# EAGLE schematic zikzak3-memswitch3 (EAGLE 6.4)
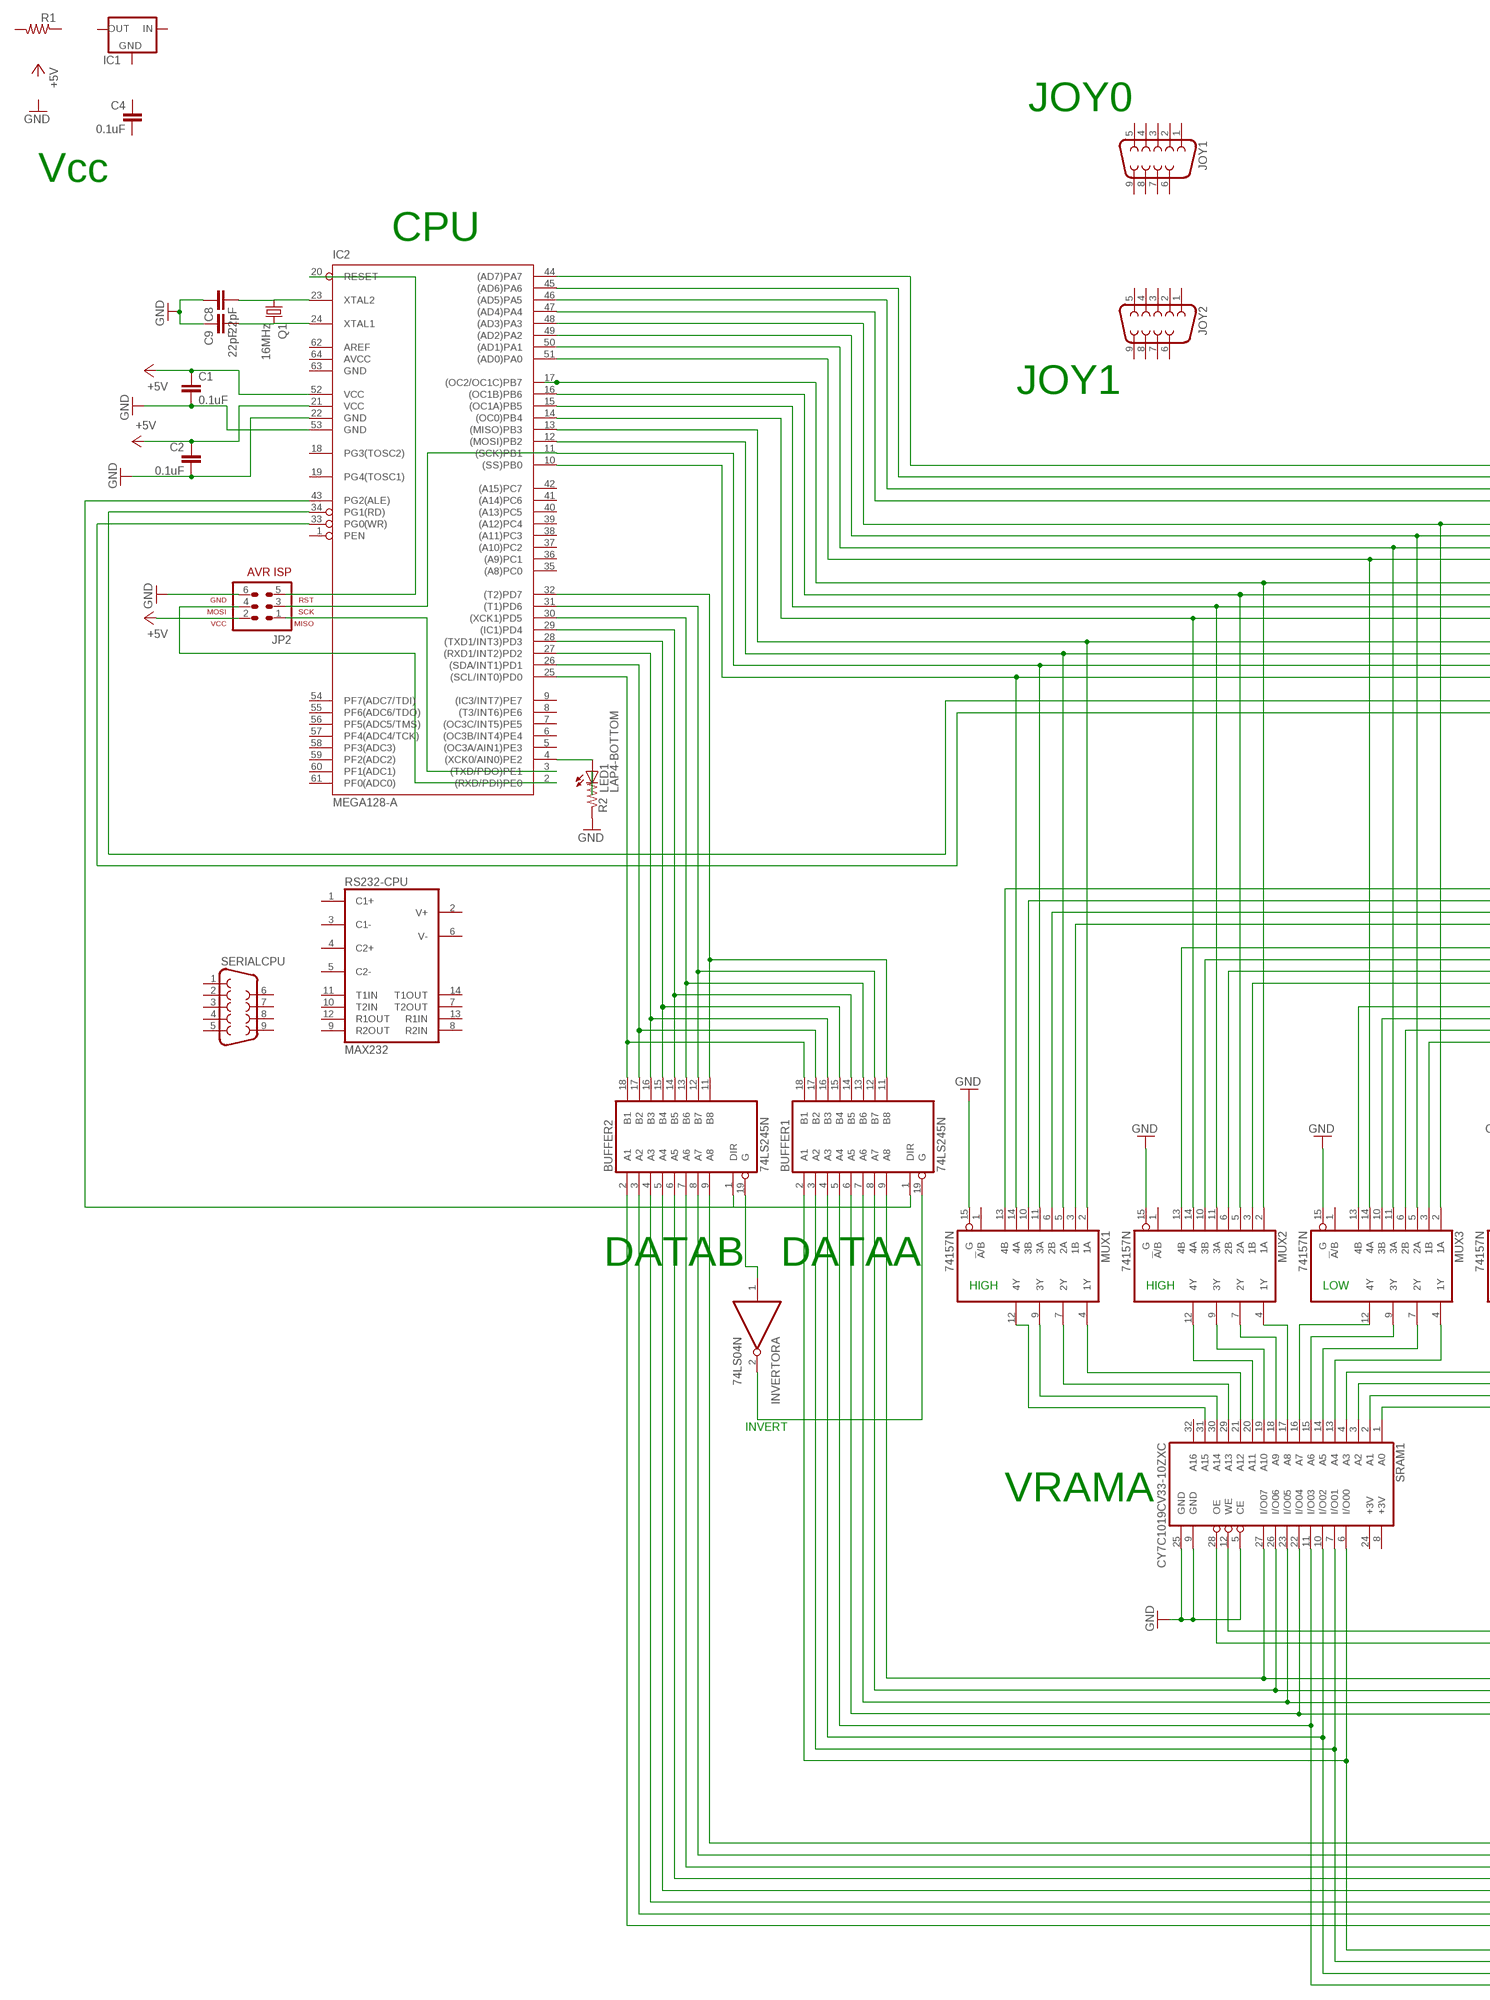
[diagram p0: schematic, sheet 1, part 1 of 2]
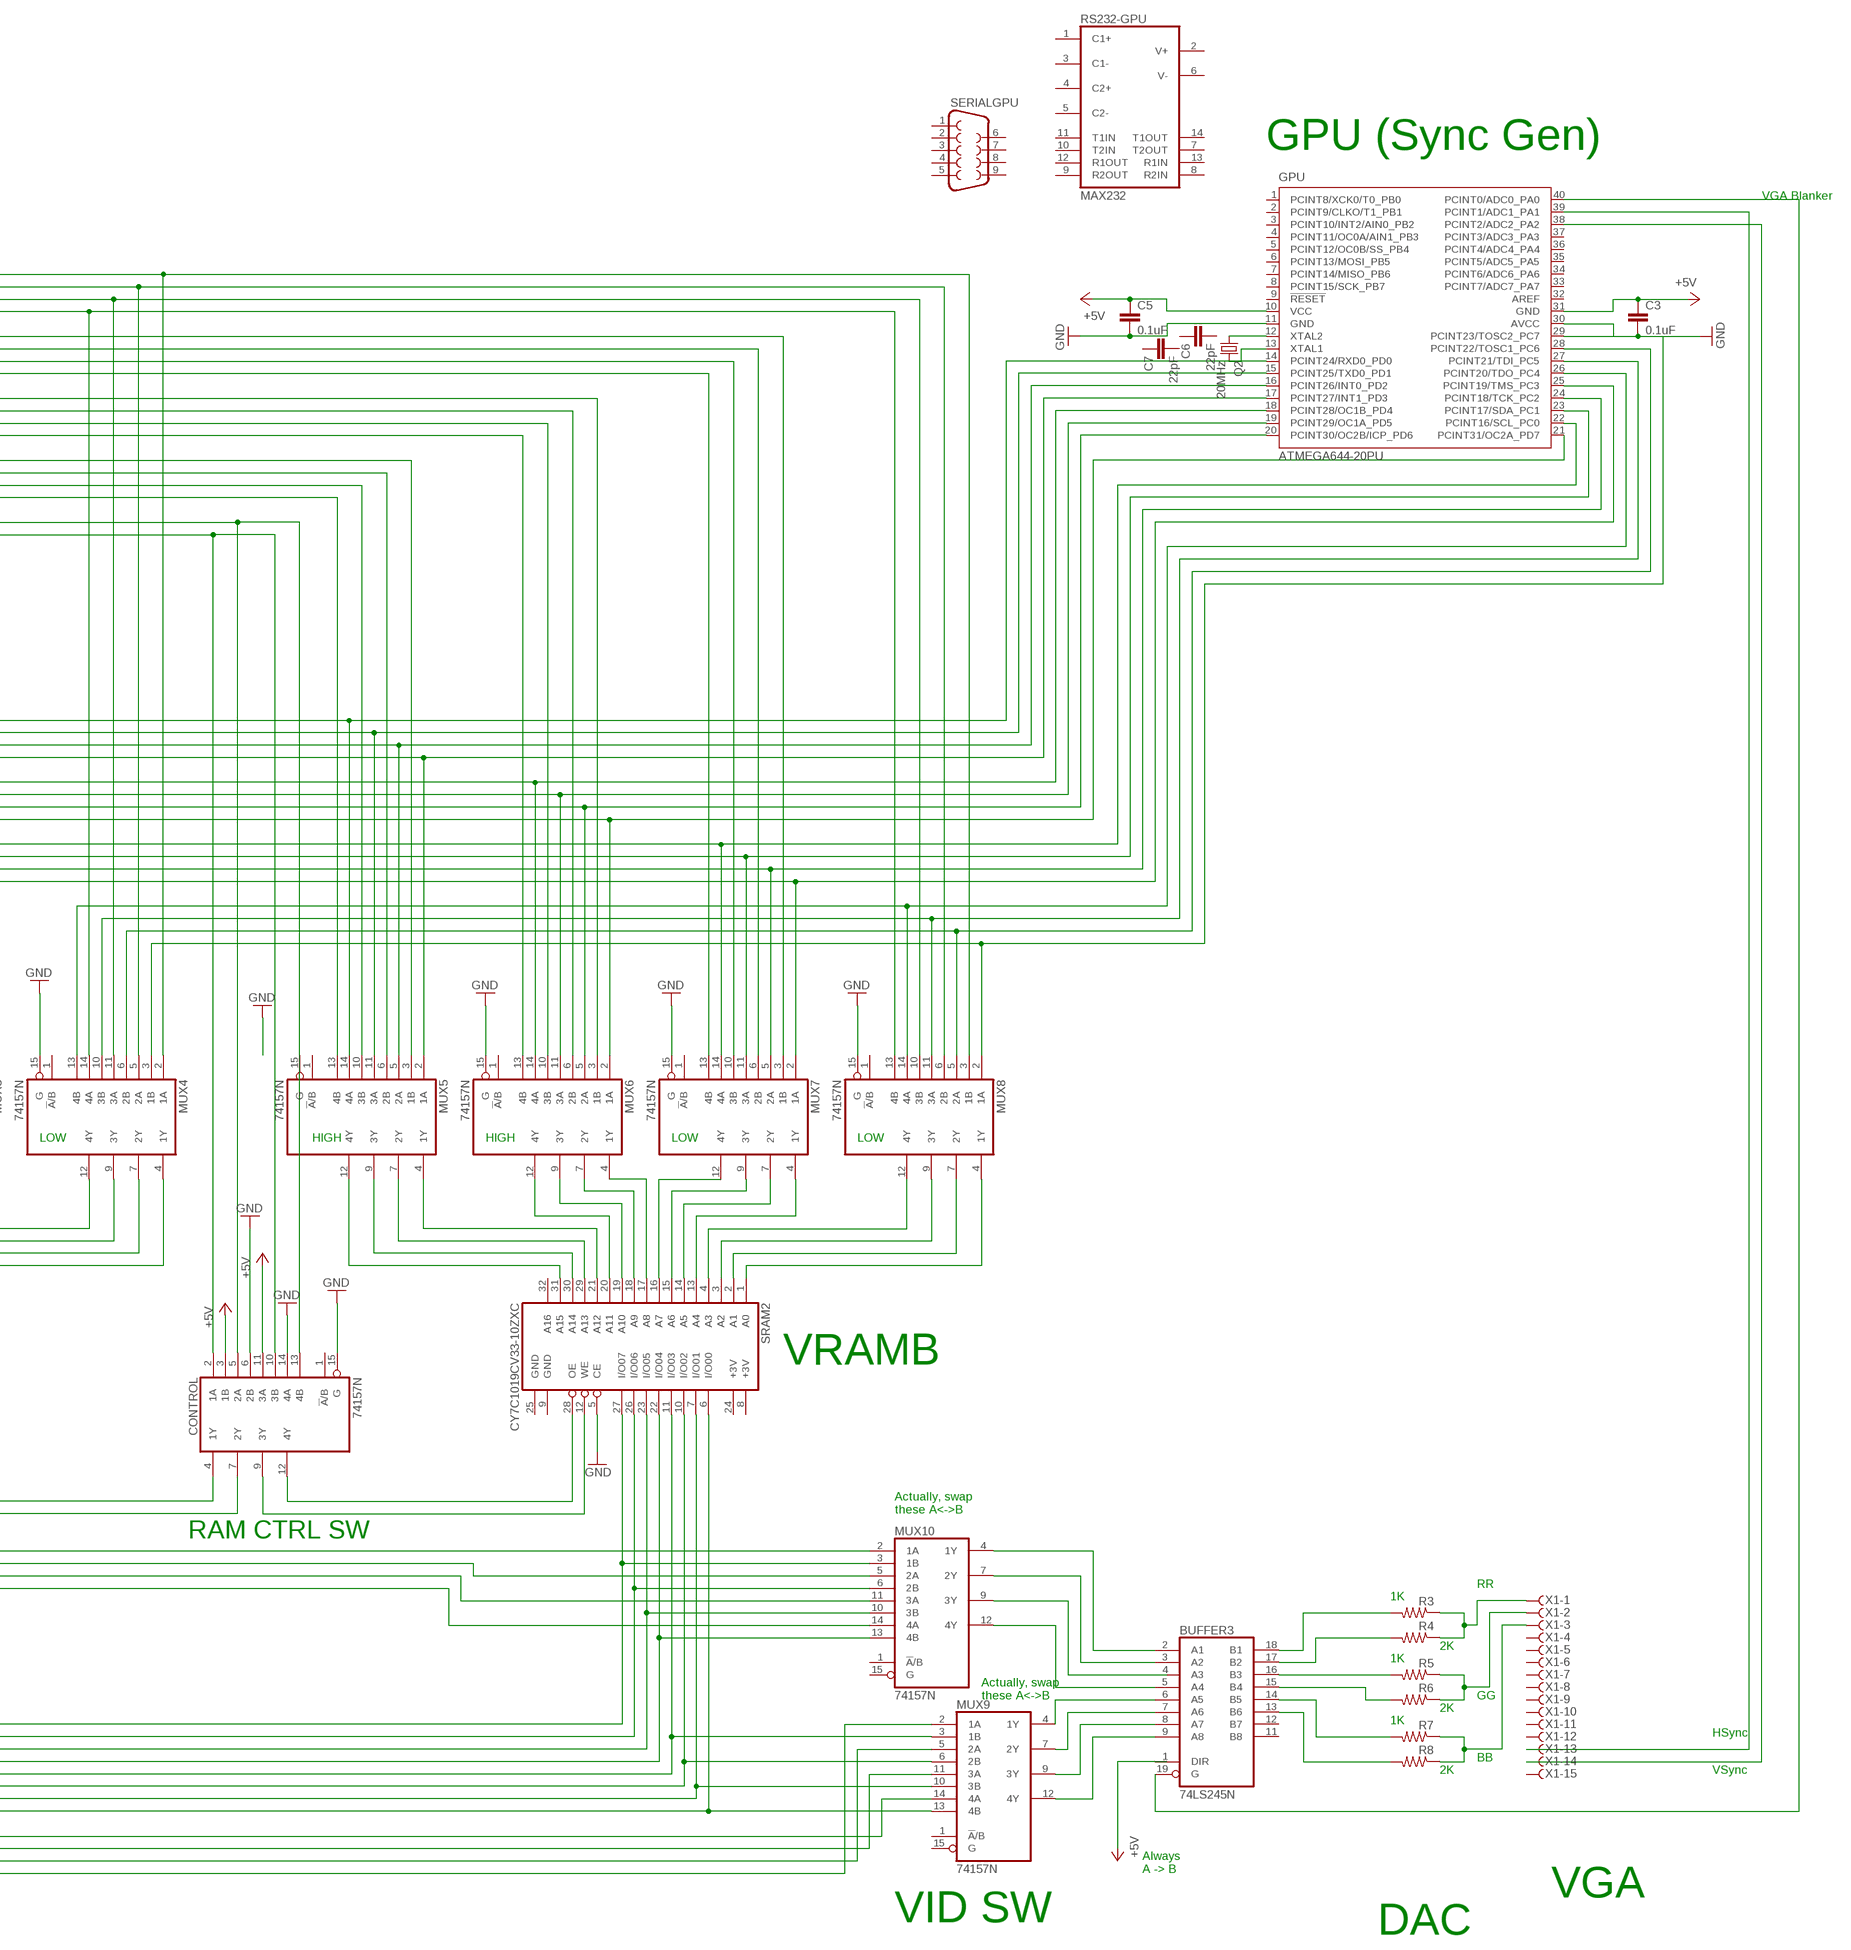
[diagram p1: schematic, sheet 1, part 2 of 2]

## Parts
BUFFER1  74LS245N  [DIL20]
BUFFER2  74LS245N  [DIL20]
BUFFER3  74LS245N  [DIL20]
C1  0.1uF  C2,5-3  [C2.5-3]
C2  0.1uF  C2,5-3  [C2.5-3]
C3  0.1uF  C2,5-3  [C2.5-3]
C4  0.1uF  C2,5-3  [C2.5-3]
C5  0.1uF  C2,5-3  [C2.5-3]
C6  22pF  C2,5-3  [C2.5-3]
C7  22pF  C2,5-3  [C2.5-3]
C8  22pF  C2,5-3  [C2.5-3]
C9  22pF  C2,5-3  [C2.5-3]
CONTROL  74157N  [DIL16]
GPU  ATMEGA644-20PU  [DIL40]
IC1  78MXXL  [78MXXL]
IC2  MEGA128-A  [TQFP64]
INVERTOR  74LS04N  [DIL14]
JOY1  F09H  [F09H]
JOY2  F09H  [F09H]
JP2  AVR-ISP-6VERT  [AVR-ISP-6]
LED1  LAP4-BOTTOM  [P47F-BOTTOM]
MUX1  74157N  [DIL16]
MUX2  74157N  [DIL16]
MUX3  74157N  [DIL16]
MUX4  74157N  [DIL16]
MUX5  74157N  [DIL16]
MUX6  74157N  [DIL16]
MUX7  74157N  [DIL16]
MUX8  74157N  [DIL16]
MUX9  74157N  [DIL16]
MUX10  74157N  [DIL16]
Q1  16MHz  CRYSTALTC38H  [TC38H]
Q2  20MHz  CRYSTALTC38H  [TC38H]
R1  R-US_0204/2V  [0204V]
R2  R-US_0204/2V  [0204V]
R3  R-US_0204/2V  [0204V]
R4  R-US_0204/2V  [0204V]
R5  R-US_0204/2V  [0204V]
R6  R-US_0204/2V  [0204V]
R7  R-US_0204/2V  [0204V]
R8  R-US_0204/2V  [0204V]
RS232-CPU  MAX232  [DIL16]
RS232-GPU  MAX232  [DIL16]
SERIALCPU  F09H  [F09H]
SERIALGPU  F09H  [F09H]
SRAM1  CY7C1019CV33-10ZXC  [TSOPII-32]
SRAM2  CY7C1019CV33-10ZXC  [TSOPII-32]
X1  F15HDVS  [HDF15V]

## Nets
+5V: C1.1 C2.1 C3.1 C5.1 CONTROL.3(1B) CONTROL.11(3A) GPU.10(VCC) GPU.31(GND) IC2.21(VCC) IC2.52(VCC) JP2.2
GND: C1.2 C2.2 C3.2 C5.2 C8.1 C9.1 CONTROL.6(2B) CONTROL.14(4A) CONTROL.15(G) GPU.11(GND) GPU.30(AVCC) IC2.22(GND) IC2.53(GND) JP2.6 MUX1.15(G) MUX2.15(G) MUX3.15(G) MUX4.15(G) MUX6.15(G) MUX7.15(G) MUX8.15(G) R2.1 SRAM1.5(CE) SRAM1.9(GND) SRAM1.25(GND) SRAM2.5(CE)
N$1: LED1.C R2.2
N$2: CONTROL.5(2A) CONTROL.13(4B) IC2.34(PG1(RD))
N$3: CONTROL.2(1A) CONTROL.10(3B) IC2.33(PG0(WR))
N$4: CONTROL.7(2Y) SRAM1.28(OE)
N$5: CONTROL.4(1Y) SRAM1.12(WE)
N$6: CONTROL.9(3Y) SRAM2.12(WE)
N$7: IC2.4((XCK0/AIN0)PE2) LED1.A
N$8: CONTROL.12(4Y) SRAM2.28(OE)
N$9: GPU.12(XTAL2) Q2.1
N$10: GPU.13(XTAL1) Q2.2
N$11: BUFFER3.5(A4) MUX10.12(4Y)
N$12: MUX10.9(3Y)
N$13: MUX6.4(1Y) SRAM2.17(A8)
N$14: MUX6.7(2Y) SRAM2.18(A9)
N$15: MUX6.9(3Y) SRAM2.19(A10)
N$16: MUX6.12(4Y) SRAM2.20(A11)
N$17: MUX5.4(1Y) SRAM2.21(A12)
N$18: MUX5.7(2Y) SRAM2.29(A13)
N$19: MUX5.9(3Y) SRAM2.30(A14)
N$20: MUX5.12(4Y) SRAM2.31(A15)
N$21: MUX7.12(4Y) SRAM2.16(A7)
N$22: MUX7.9(3Y) SRAM2.15(A6)
N$23: MUX7.7(2Y) SRAM2.14(A5)
N$24: MUX7.4(1Y) SRAM2.13(A4)
N$25: MUX8.12(4Y) SRAM2.4(A3)
N$26: MUX8.9(3Y) SRAM2.3(A2)
N$27: MUX8.7(2Y) SRAM2.2(A1)
N$28: MUX8.4(1Y) SRAM2.1(A0)
N$29: GPU.14(PCINT24/RXD0_PD0) MUX1.13(4B) MUX5.14(4A)
N$30: GPU.15(PCINT25/TXD0_PD1) MUX1.10(3B) MUX5.11(3A)
N$31: GPU.16(PCINT26/INT0_PD2) MUX1.6(2B) MUX5.5(2A)
N$32: GPU.17(PCINT27/INT1_PD3) MUX1.3(1B) MUX5.2(1A)
N$33: GPU.18(PCINT28/OC1B_PD4) MUX2.13(4B) MUX6.14(4A)
N$34: GPU.19(PCINT29/OC1A_PD5) MUX2.10(3B) MUX6.11(3A)
N$35: GPU.20(PCINT30/OC2B/ICP_PD6) MUX2.6(2B) MUX6.5(2A)
N$36: GPU.21(PCINT31/OC2A_PD7) MUX2.3(1B) MUX6.2(1A)
N$37: GPU.22(PCINT16/SCL_PC0) MUX3.13(4B) MUX7.14(4A)
N$38: GPU.23(PCINT17/SDA_PC1) MUX3.10(3B) MUX7.11(3A)
N$39: GPU.24(PCINT18/TCK_PC2) MUX3.6(2B) MUX7.5(2A)
N$40: GPU.25(PCINT19/TMS_PC3) MUX3.3(1B) MUX7.2(1A)
N$41: GPU.26(PCINT20/TDO_PC4) MUX4.13(4B) MUX8.14(4A)
N$42: GPU.27(PCINT21/TDI_PC5) MUX4.10(3B) MUX8.11(3A)
N$43: GPU.28(PCINT22/TOSC1_PC6) MUX4.6(2B) MUX8.5(2A)
N$44: GPU.29(PCINT23/TOSC2_PC7) MUX4.3(1B) MUX8.2(1A)
N$45: MUX3.12(4Y) SRAM1.16(A7)
N$46: MUX3.9(3Y) SRAM1.15(A6)
N$47: MUX3.7(2Y) SRAM1.14(A5)
N$48: MUX3.4(1Y) SRAM1.13(A4)
N$49: MUX4.12(4Y) SRAM1.4(A3)
N$50: MUX4.9(3Y) SRAM1.3(A2)
N$51: MUX4.7(2Y) SRAM1.2(A1)
N$52: MUX4.4(1Y) SRAM1.1(A0)
N$53: MUX2.4(1Y) SRAM1.17(A8)
N$54: MUX2.7(2Y) SRAM1.18(A9)
N$55: MUX2.9(3Y) SRAM1.19(A10)
N$56: MUX2.12(4Y) SRAM1.20(A11)
N$57: MUX1.4(1Y) SRAM1.21(A12)
N$58: MUX1.7(2Y) SRAM1.29(A13)
N$59: MUX1.9(3Y) SRAM1.30(A14)
N$60: MUX1.12(4Y) SRAM1.31(A15)
N$61: IC2.44((AD7)PA7) MUX4.2(1A) MUX8.3(1B)
N$62: IC2.45((AD6)PA6) MUX4.5(2A) MUX8.6(2B)
N$63: IC2.46((AD5)PA5) MUX4.11(3A) MUX8.10(3B)
N$64: IC2.47((AD4)PA4) MUX4.14(4A) MUX8.13(4B)
N$65: IC2.48((AD3)PA3) MUX3.2(1A) MUX7.3(1B)
N$66: IC2.49((AD2)PA2) MUX3.5(2A) MUX7.6(2B)
N$67: IC2.50((AD1)PA1) MUX3.11(3A) MUX7.10(3B)
N$68: IC2.51((AD0)PA0) MUX3.14(4A) MUX7.13(4B)
N$69: IC2.17((OC2/OC1C)PB7) MUX2.2(1A) MUX6.3(1B)
N$70: IC2.16((OC1B)PB6) MUX2.5(2A) MUX6.6(2B)
N$71: IC2.15((OC1A)PB5) MUX2.11(3A) MUX6.10(3B)
N$72: IC2.14((OC0)PB4) MUX2.14(4A) MUX6.13(4B)
N$73: IC2.13((MISO)PB3) MUX1.2(1A) MUX5.3(1B)
N$74: IC2.12((MOSI)PB2) MUX1.5(2A) MUX5.6(2B)
N$75: MUX1.11(3A) MUX5.10(3B)
N$76: IC2.10((SS)PB0) MUX1.14(4A) MUX5.13(4B)
N$77: BUFFER1.9(A8) MUX10.2(1A) SRAM1.27(I/O07)
N$78: IC2.2((RXD/PDI)PE0) JP2.4
N$79: IC2.3((TXD/PDO)PE1) JP2.1
N$80: IC2.11((SCK)PB1) JP2.3
N$81: IC2.20(RESET) JP2.5
N$82: BUFFER1.8(A7) MUX10.5(2A) SRAM1.26(I/O06)
N$83: BUFFER1.7(A6) MUX10.11(3A) SRAM1.23(I/O05)
N$84: BUFFER1.6(A5) MUX10.14(4A) SRAM1.22(I/O04)
N$85: BUFFER1.5(A4) MUX9.2(1A) SRAM1.11(I/O03)
N$86: BUFFER1.4(A3) MUX9.5(2A) SRAM1.10(I/O02)
N$87: BUFFER1.3(A2) MUX9.11(3A) SRAM1.7(I/O01)
N$88: BUFFER1.2(A1) MUX9.14(4A) SRAM1.6(I/O00)
N$89: BUFFER2.9(A8) MUX10.3(1B) SRAM2.27(I/O07)
N$90: BUFFER2.8(A7) MUX10.6(2B) SRAM2.26(I/O06)
N$91: BUFFER2.7(A6) MUX10.10(3B) SRAM2.23(I/O05)
N$92: BUFFER2.6(A5) MUX10.13(4B) SRAM2.22(I/O04)
N$93: BUFFER2.5(A4) MUX9.3(1B) SRAM2.11(I/O03)
N$94: BUFFER2.4(A3) MUX9.6(2B) SRAM2.10(I/O02)
N$95: BUFFER2.3(A2) MUX9.10(3B) SRAM2.7(I/O01)
N$96: BUFFER2.2(A1) MUX9.13(4B) SRAM2.6(I/O00)
N$97: BUFFER1.18(B1) BUFFER2.18(B1) IC2.25((SCL/INT0)PD0)
N$98: BUFFER1.17(B2) BUFFER2.17(B2) IC2.26((SDA/INT1)PD1)
N$99: BUFFER1.16(B3) BUFFER2.16(B3) IC2.27((RXD1/INT2)PD2)
N$100: BUFFER1.15(B4) BUFFER2.15(B4) IC2.28((TXD1/INT3)PD3)
N$101: BUFFER1.14(B5) BUFFER2.14(B5) IC2.29((IC1)PD4)
N$102: BUFFER1.13(B6) BUFFER2.13(B6) IC2.30((XCK1)PD5)
N$103: BUFFER1.12(B7) BUFFER2.12(B7) IC2.31((T1)PD6)
N$104: BUFFER1.11(B8) BUFFER2.11(B8) IC2.32((T2)PD7)
N$105: BUFFER3.3(A2) MUX10.7(2Y)
N$106: BUFFER3.2(A1) MUX10.4(1Y)
N$107: BUFFER2.19(G) INVERTOR.1(A:I)
N$108: BUFFER1.19(G) INVERTOR.2(A:O)
N$109: BUFFER3.6(A5) MUX9.4(1Y)
N$110: BUFFER3.7(A6) MUX9.7(2Y)
N$111: BUFFER3.8(A7) MUX9.9(3Y)
N$112: BUFFER3.9(A8) MUX9.12(4Y)
N$113: BUFFER3.18(B1) R3.2
N$114: BUFFER3.17(B2) R4.2
N$115: BUFFER3.16(B3) R5.2
N$116: BUFFER3.15(B4) R6.2
N$117: BUFFER3.14(B5) R7.2
N$118: BUFFER3.13(B6) R8.2
N$119: R3.1 R4.1 X1.1
N$120: C8.2 IC2.23(XTAL2) Q1.1
N$121: R5.1 R6.1 X1.2
N$122: GPU.39(PCINT1/ADC1_PA1) X1.13
N$123: R7.1 R8.1 X1.3
N$124: GPU.38(PCINT2/ADC2_PA2) X1.14
N$125: BUFFER3.19(G) GPU.40(PCINT0/ADC0_PA0)
N$126: C9.2 IC2.24(XTAL1) Q1.2
N$128: BUFFER1.1(DIR) BUFFER2.1(DIR) IC2.43(PG2(ALE))
Unconnected: BUFFER3.1(DIR) BUFFER3.4(A3) BUFFER3.11(B8) BUFFER3.12(B7) C4.1 C4.2 C6.1 C6.2 C7.1 C7.2 CONTROL.1(!A!/B) GPU.1(PCINT8/XCK0/T0_PB0) GPU.2(PCINT9/CLKO/T1_PB1) GPU.3(PCINT10/INT2/AIN0_PB2) GPU.4(PCINT11/OC0A/AIN1_PB3) GPU.5(PCINT12/OC0B/SS_PB4) GPU.6(PCINT13/MOSI_PB5) GPU.7(PCINT14/MISO_PB6) GPU.8(PCINT15/SCK_PB7) GPU.9(!RESET) GPU.32(AREF) GPU.33(PCINT7/ADC7_PA7) GPU.34(PCINT6/ADC6_PA6) GPU.35(PCINT5/ADC5_PA5) GPU.36(PCINT4/ADC4_PA4) GPU.37(PCINT3/ADC3_PA3) IC1.GND IC1.IN IC1.OUT IC2.1(PEN) IC2.5((OC3A/AIN1)PE3) IC2.6((OC3B/INT4)PE4) IC2.7((OC3C/INT5)PE5) IC2.8((T3/INT6)PE6) IC2.9((IC3/INT7)PE7) IC2.18(PG3(TOSC2)) IC2.19(PG4(TOSC1)) IC2.35((A8)PC0) IC2.36((A9)PC1) IC2.37((A10)PC2) IC2.38((A11)PC3) IC2.39((A12)PC4) IC2.40((A13)PC5) IC2.41((A14)PC6) IC2.42((A15)PC7) IC2.54(PF7(ADC7/TDI)) IC2.55(PF6(ADC6/TDO)) IC2.56(PF5(ADC5/TMS)) IC2.57(PF4(ADC4/TCK)) IC2.58(PF3(ADC3)) IC2.59(PF2(ADC2)) IC2.60(PF1(ADC1)) IC2.61(PF0(ADC0)) IC2.62(AREF) INVERTOR.3(B:I) INVERTOR.4(B:O) INVERTOR.5(C:I) INVERTOR.6(C:O) INVERTOR.8(D:O) INVERTOR.9(D:I) INVERTOR.10(E:O) INVERTOR.11(E:I) INVERTOR.12(F:O) INVERTOR.13(F:I) JOY1.1 JOY1.2 JOY1.3 JOY1.4 JOY1.5 JOY1.6 JOY1.7 JOY1.8 JOY1.9 JOY2.1 JOY2.2 JOY2.3 JOY2.4 JOY2.5 JOY2.6 JOY2.7 JOY2.8 JOY2.9 MUX1.1(!A!/B) MUX2.1(!A!/B) MUX3.1(!A!/B) MUX4.1(!A!/B) MUX5.1(!A!/B) MUX5.15(G) MUX6.1(!A!/B) MUX7.1(!A!/B) MUX8.1(!A!/B) MUX9.1(!A!/B) MUX9.15(G) MUX10.1(!A!/B) MUX10.15(G) R1.1 R1.2 RS232-CPU.1(C1+) RS232-CPU.2(V+) RS232-CPU.3(C1-) RS232-CPU.4(C2+) RS232-CPU.5(C2-) RS232-CPU.6(V-) RS232-CPU.7(T2OUT) RS232-CPU.8(R2IN) RS232-CPU.9(R2OUT) RS232-CPU.10(T2IN) RS232-CPU.11(T1IN) RS232-CPU.12(R1OUT) RS232-CPU.13(R1IN) RS232-CPU.14(T1OUT) RS232-GPU.1(C1+) RS232-GPU.2(V+) RS232-GPU.3(C1-) RS232-GPU.4(C2+) RS232-GPU.5(C2-) RS232-GPU.6(V-) RS232-GPU.7(T2OUT) RS232-GPU.8(R2IN) RS232-GPU.9(R2OUT) RS232-GPU.10(T2IN) RS232-GPU.11(T1IN) RS232-GPU.12(R1OUT) RS232-GPU.13(R1IN) RS232-GPU.14(T1OUT) SERIALCPU.1 SERIALCPU.2 SERIALCPU.3 SERIALCPU.4 SERIALCPU.5 SERIALCPU.6 SERIALCPU.7 SERIALCPU.8 SERIALCPU.9 SERIALGPU.1 SERIALGPU.2 SERIALGPU.3 SERIALGPU.4 SERIALGPU.5 SERIALGPU.6 SERIALGPU.7 SERIALGPU.8 SERIALGPU.9 SRAM1.32(A16) SRAM2.32(A16) X1.4 X1.5 X1.6 X1.7 X1.8 X1.9 X1.10 X1.11 X1.12 X1.15

## Notes on the sheet
- JOY0
- Vcc
- CPU
- GPU (Sync Gen)
- JOY1 | VGA Blanker
- DATAB | DATAA
- HIGH | HIGH | LOW | LOW | HIGH | HIGH | LOW | LOW
- INVERT
- VRAMA | VRAMB
- Actually, swap
  these A<->B
- RAM CTRL SW
- RR
- 1K
- 2K
- 1K
- Actually, swap
  these A<->B
- GG
- 2K
- 1K
- HSync
- BB
- 2K | VSync
- Always
  A -> B
- VGA
- VID SW | DAC

## Power pins joined to a net without a drawn wire
+3V: SRAM1.8(+3V) SRAM1.24(+3V) SRAM2.8(+3V) SRAM2.24(+3V)
AVCC: IC2.64(AVCC)
GND: BUFFER1.10(GND) BUFFER2.10(GND) BUFFER3.10(GND) CONTROL.8(GND) IC2.63(GND) INVERTOR.7(P:GND) MUX1.8(GND) MUX2.8(GND) MUX3.8(GND) MUX4.8(GND) MUX5.8(GND) MUX6.8(GND) MUX7.8(GND) MUX8.8(GND) MUX9.8(GND) MUX10.8(GND) RS232-CPU.15(GND) RS232-GPU.15(GND) SRAM2.9(GND) SRAM2.25(GND)
VCC: BUFFER1.20(VCC) BUFFER2.20(VCC) BUFFER3.20(VCC) CONTROL.16(VCC) INVERTOR.14(P:VCC) MUX1.16(VCC) MUX2.16(VCC) MUX3.16(VCC) MUX4.16(VCC) MUX5.16(VCC) MUX6.16(VCC) MUX7.16(VCC) MUX8.16(VCC) MUX9.16(VCC) MUX10.16(VCC) RS232-CPU.16(VCC) RS232-GPU.16(VCC)

## Library data of the parts
BUFFER1-BUFFER3 = 74xx-us:74*245: Octal BUS TRANSCEIVER, 3-state
C1-C9 = capacitor-wima:C: CAPACITOR naming: grid - package width
CONTROL MUX1-MUX10 = 74xx-us:74*157: Quadruple 2-line to 1-line data SELECTOR/MULTIPLEXER
GPU = atmel:ATMEGA644-*PU: 8-bit Microcontroller with 64K Bytes In-System Programmable Flash Auto generated by make-symbol-device-package-bsdl.ulp Rev. 34 Source: http://www.atmel.com/dyn/resources/prod_documents/doc2593.pdf; MPN: ATMEGA644-20PU; OC_FARNELL: 1288340; OC_NEWARK: 23M5060
IC1 = v-reg:78MXXL: VOLTAGE REGULATOR
IC2 = atmel:MEGA128: MICROCONTROLLER 128 Kbytes FLASH 4 Kbytes SRAM 4 Kbytes EEPROM DUAL USART 8-channel 10 bit ADC Source: avr.lbr; MPN: ATMEGA128-16AU; OC_FARNELL: 9171118; OC_NEWARK: 95K7364
INVERTOR = 74xx-us:74*04: Hex INVERTER
JOY1 JOY2 SERIALCPU SERIALGPU = con-subd:F09: SUB-D; OC_FARNELL: unknown; OC_NEWARK: unknown
JP2 = avr-7:AVR-ISP-6: AVR ISP-6 Serial Programming Header
LED1 = led:*P4: PointLED® Enhanced Thinfilm LED TOP & BOTTOM mount LS P47F, LR P47F, LA P47F, LY P47F, LT P4SG, LB P4SG, LW P4SG Source: http://catalog.osram-os.com .. LA_LR_LS_LY_P47F_Pb_free.pdf
Q1 Q2 = crystal:CRYSTAL: CRYSTAL; OC_FARNELL: unknown; OC_NEWARK: unknown
R1-R8 = rcl:R-US_: RESISTOR, American symbol
RS232-CPU RS232-GPU = maxim:MAX232: RS232 TRANSEIVER; MF: MAXIM; MPN: MAX232ACPE+; OC_FARNELL: 9723773; OC_NEWARK: 68K4544
SRAM1 SRAM2 = memory-sram:CY7C1019CV33: 128K x 8 Static RAM 10ns Source: Cypress CYP05780611.pdf
X1 = con-subd:F15?S: SUB-D; OC_FARNELL: unknown; OC_NEWARK: unknown